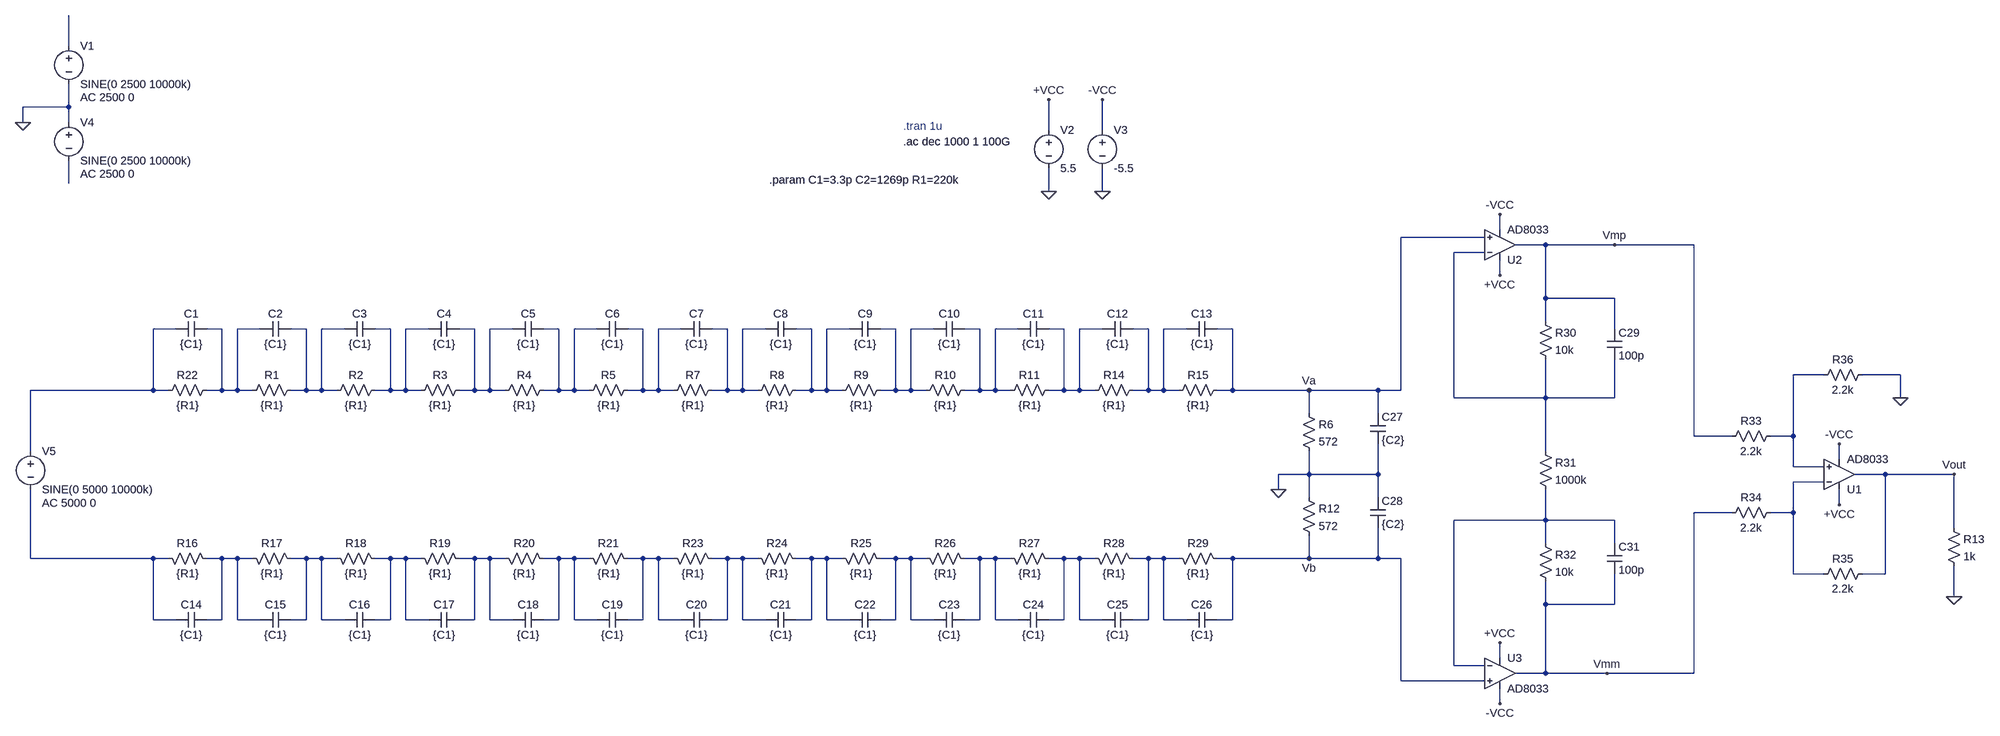
[diagram p0: schematic InputCircuit_Test3.asc]
InputCircuit_Test3.asc, the LTspice schematic file:
Version 4
SHEET 1 2388 756
WIRE -1920 -752 -1920 -816
WIRE -1920 -624 -1920 -672
WIRE -1920 -624 -2016 -624
WIRE -2016 -592 -2016 -624
WIRE -1920 -592 -1920 -624
WIRE 128 -576 128 -640
WIRE 240 -576 240 -640
WIRE -1920 -464 -1920 -512
WIRE 128 -448 128 -496
WIRE 240 -448 240 -496
WIRE 1184 -368 1184 -400
WIRE 1152 -352 864 -352
WIRE 1280 -336 1216 -336
WIRE 1424 -336 1280 -336
WIRE 1776 -336 1424 -336
WIRE 1152 -320 1088 -320
WIRE 1184 -272 1184 -304
WIRE 1280 -224 1280 -336
WIRE 1424 -224 1280 -224
WIRE 1280 -176 1280 -224
WIRE -1696 -160 -1744 -160
WIRE -1600 -160 -1632 -160
WIRE -1520 -160 -1568 -160
WIRE -1424 -160 -1456 -160
WIRE -1344 -160 -1392 -160
WIRE -1248 -160 -1280 -160
WIRE -1168 -160 -1216 -160
WIRE -1072 -160 -1104 -160
WIRE -992 -160 -1040 -160
WIRE -896 -160 -928 -160
WIRE -816 -160 -864 -160
WIRE -720 -160 -752 -160
WIRE -640 -160 -688 -160
WIRE -544 -160 -576 -160
WIRE -464 -160 -512 -160
WIRE -368 -160 -400 -160
WIRE -288 -160 -336 -160
WIRE -192 -160 -224 -160
WIRE -112 -160 -160 -160
WIRE -16 -160 -48 -160
WIRE 64 -160 16 -160
WIRE 160 -160 128 -160
WIRE 240 -160 192 -160
WIRE 336 -160 304 -160
WIRE 416 -160 368 -160
WIRE 512 -160 480 -160
WIRE 1424 -160 1424 -224
WIRE 2048 -64 1984 -64
WIRE 2208 -64 2128 -64
WIRE -1744 -32 -1744 -160
WIRE -1744 -32 -2000 -32
WIRE -1712 -32 -1744 -32
WIRE -1600 -32 -1600 -160
WIRE -1600 -32 -1632 -32
WIRE -1568 -32 -1568 -160
WIRE -1568 -32 -1600 -32
WIRE -1536 -32 -1568 -32
WIRE -1424 -32 -1424 -160
WIRE -1424 -32 -1456 -32
WIRE -1392 -32 -1392 -160
WIRE -1392 -32 -1424 -32
WIRE -1360 -32 -1392 -32
WIRE -1248 -32 -1248 -160
WIRE -1248 -32 -1280 -32
WIRE -1216 -32 -1216 -160
WIRE -1216 -32 -1248 -32
WIRE -1184 -32 -1216 -32
WIRE -1072 -32 -1072 -160
WIRE -1072 -32 -1104 -32
WIRE -1040 -32 -1040 -160
WIRE -1040 -32 -1072 -32
WIRE -1008 -32 -1040 -32
WIRE -896 -32 -896 -160
WIRE -896 -32 -928 -32
WIRE -864 -32 -864 -160
WIRE -864 -32 -896 -32
WIRE -832 -32 -864 -32
WIRE -720 -32 -720 -160
WIRE -720 -32 -752 -32
WIRE -688 -32 -688 -160
WIRE -688 -32 -720 -32
WIRE -656 -32 -688 -32
WIRE -544 -32 -544 -160
WIRE -544 -32 -576 -32
WIRE -512 -32 -512 -160
WIRE -512 -32 -544 -32
WIRE -480 -32 -512 -32
WIRE -368 -32 -368 -160
WIRE -368 -32 -400 -32
WIRE -336 -32 -336 -160
WIRE -336 -32 -368 -32
WIRE -304 -32 -336 -32
WIRE -192 -32 -192 -160
WIRE -192 -32 -224 -32
WIRE -160 -32 -160 -160
WIRE -160 -32 -192 -32
WIRE -128 -32 -160 -32
WIRE -16 -32 -16 -160
WIRE -16 -32 -48 -32
WIRE 16 -32 16 -160
WIRE 16 -32 -16 -32
WIRE 48 -32 16 -32
WIRE 160 -32 160 -160
WIRE 160 -32 128 -32
WIRE 192 -32 192 -160
WIRE 192 -32 160 -32
WIRE 224 -32 192 -32
WIRE 336 -32 336 -160
WIRE 336 -32 304 -32
WIRE 368 -32 368 -160
WIRE 368 -32 336 -32
WIRE 400 -32 368 -32
WIRE 512 -32 512 -160
WIRE 512 -32 480 -32
WIRE 672 -32 512 -32
WIRE 816 -32 672 -32
WIRE 864 -32 864 -352
WIRE 864 -32 816 -32
WIRE 1088 -16 1088 -320
WIRE 1280 -16 1280 -96
WIRE 1280 -16 1088 -16
WIRE 1424 -16 1424 -96
WIRE 1424 -16 1280 -16
WIRE 2208 -16 2208 -64
WIRE 672 16 672 -32
WIRE 816 16 816 -32
WIRE 1776 64 1776 -336
WIRE 1856 64 1776 64
WIRE 1984 64 1984 -64
WIRE 1984 64 1936 64
WIRE -2000 96 -2000 -32
WIRE 1280 96 1280 -16
WIRE 2080 112 2080 80
WIRE 1984 128 1984 64
WIRE 2048 128 1984 128
WIRE 672 144 672 96
WIRE 672 144 608 144
WIRE 816 144 816 80
WIRE 816 144 672 144
WIRE 2176 144 2112 144
WIRE 2320 144 2176 144
WIRE 2048 160 1984 160
WIRE 608 176 608 144
WIRE 672 192 672 144
WIRE 816 192 816 144
WIRE 2080 208 2080 176
WIRE 1856 224 1776 224
WIRE 1984 224 1984 160
WIRE 1984 224 1936 224
WIRE 1280 240 1280 176
WIRE 1280 240 1088 240
WIRE 1424 240 1280 240
WIRE 2320 256 2320 144
WIRE 1280 288 1280 240
WIRE 1424 288 1424 240
WIRE -2000 320 -2000 176
WIRE -1744 320 -2000 320
WIRE -1712 320 -1744 320
WIRE -1600 320 -1632 320
WIRE -1568 320 -1600 320
WIRE -1536 320 -1568 320
WIRE -1424 320 -1456 320
WIRE -1392 320 -1424 320
WIRE -1360 320 -1392 320
WIRE -1248 320 -1280 320
WIRE -1216 320 -1248 320
WIRE -1184 320 -1216 320
WIRE -1072 320 -1104 320
WIRE -1040 320 -1072 320
WIRE -1008 320 -1040 320
WIRE -896 320 -928 320
WIRE -864 320 -896 320
WIRE -832 320 -864 320
WIRE -720 320 -752 320
WIRE -688 320 -720 320
WIRE -656 320 -688 320
WIRE -544 320 -576 320
WIRE -512 320 -544 320
WIRE -480 320 -512 320
WIRE -368 320 -400 320
WIRE -336 320 -368 320
WIRE -304 320 -336 320
WIRE -192 320 -224 320
WIRE -160 320 -192 320
WIRE -128 320 -160 320
WIRE -16 320 -48 320
WIRE 16 320 -16 320
WIRE 48 320 16 320
WIRE 160 320 128 320
WIRE 192 320 160 320
WIRE 224 320 192 320
WIRE 336 320 304 320
WIRE 368 320 336 320
WIRE 400 320 368 320
WIRE 512 320 480 320
WIRE 672 320 672 272
WIRE 672 320 512 320
WIRE 816 320 816 256
WIRE 816 320 672 320
WIRE 864 320 816 320
WIRE 1984 352 1984 224
WIRE 2048 352 1984 352
WIRE 2176 352 2176 144
WIRE 2176 352 2128 352
WIRE 2320 400 2320 336
WIRE 1280 416 1280 368
WIRE 1424 416 1424 352
WIRE 1424 416 1280 416
WIRE -1744 448 -1744 320
WIRE -1696 448 -1744 448
WIRE -1600 448 -1600 320
WIRE -1600 448 -1632 448
WIRE -1568 448 -1568 320
WIRE -1520 448 -1568 448
WIRE -1424 448 -1424 320
WIRE -1424 448 -1456 448
WIRE -1392 448 -1392 320
WIRE -1344 448 -1392 448
WIRE -1248 448 -1248 320
WIRE -1248 448 -1280 448
WIRE -1216 448 -1216 320
WIRE -1168 448 -1216 448
WIRE -1072 448 -1072 320
WIRE -1072 448 -1104 448
WIRE -1040 448 -1040 320
WIRE -992 448 -1040 448
WIRE -896 448 -896 320
WIRE -896 448 -928 448
WIRE -864 448 -864 320
WIRE -816 448 -864 448
WIRE -720 448 -720 320
WIRE -720 448 -752 448
WIRE -688 448 -688 320
WIRE -640 448 -688 448
WIRE -544 448 -544 320
WIRE -544 448 -576 448
WIRE -512 448 -512 320
WIRE -464 448 -512 448
WIRE -368 448 -368 320
WIRE -368 448 -400 448
WIRE -336 448 -336 320
WIRE -288 448 -336 448
WIRE -192 448 -192 320
WIRE -192 448 -224 448
WIRE -160 448 -160 320
WIRE -112 448 -160 448
WIRE -16 448 -16 320
WIRE -16 448 -48 448
WIRE 16 448 16 320
WIRE 64 448 16 448
WIRE 160 448 160 320
WIRE 160 448 128 448
WIRE 192 448 192 320
WIRE 240 448 192 448
WIRE 336 448 336 320
WIRE 336 448 304 448
WIRE 368 448 368 320
WIRE 416 448 368 448
WIRE 512 448 512 320
WIRE 512 448 480 448
WIRE 1184 528 1184 496
WIRE 1088 544 1088 240
WIRE 1152 544 1088 544
WIRE 1280 560 1280 416
WIRE 1280 560 1216 560
WIRE 1408 560 1280 560
WIRE 1776 560 1776 224
WIRE 1776 560 1408 560
WIRE 864 576 864 320
WIRE 1152 576 864 576
WIRE 1184 624 1184 592
FLAG 672 -32 Va
FLAG 672 320 Vb
FLAG 608 176 0
FLAG 128 -448 0
FLAG 240 -448 0
FLAG 128 -640 +VCC
FLAG 240 -640 -VCC
FLAG 2320 400 0
FLAG -2016 -592 0
FLAG 2320 144 Vout
FLAG 1424 -336 Vmp
FLAG 1184 -272 +VCC
FLAG 1184 -400 -VCC
FLAG 1184 496 +VCC
FLAG 1184 624 -VCC
FLAG 1408 560 Vmm
FLAG 2080 208 +VCC
FLAG 2080 80 -VCC
FLAG 2208 -16 0
SYMBOL voltage -1920 -768 R0
WINDOW 123 24 124 Left 2
WINDOW 39 0 0 Left 0
SYMATTR Value2 AC 2500 0
SYMATTR InstName V1
SYMATTR Value SINE(0 2500 10000k)
SYMBOL res 656 0 R0
SYMATTR InstName R6
SYMATTR Value 572
SYMATTR SpiceLine tol=1 pwr=0.1
SYMBOL res 656 176 R0
SYMATTR InstName R12
SYMATTR Value 572
SYMATTR SpiceLine tol=1 pwr=0.1
SYMBOL voltage 128 -592 R0
WINDOW 123 0 0 Left 0
WINDOW 39 0 0 Left 0
SYMATTR InstName V2
SYMATTR Value 5.5
SYMBOL voltage 240 -592 R0
WINDOW 123 0 0 Left 0
WINDOW 39 0 0 Left 0
SYMATTR InstName V3
SYMATTR Value -5.5
SYMBOL res -1616 -48 R90
WINDOW 0 0 56 VBottom 2
WINDOW 3 32 56 VTop 2
SYMATTR InstName R22
SYMATTR Value {R1}
SYMATTR SpiceLine tol=0 pwr=1
SYMBOL res 2304 240 R0
SYMATTR InstName R13
SYMATTR Value 1k
SYMBOL voltage -1920 -608 R0
WINDOW 123 24 124 Left 2
WINDOW 39 0 0 Left 0
SYMATTR Value2 AC 2500 0
SYMATTR InstName V4
SYMATTR Value SINE(0 2500 10000k)
SYMBOL voltage -2000 80 R0
WINDOW 123 24 124 Left 2
WINDOW 39 0 0 Left 0
SYMATTR Value2 AC 5000 0
SYMATTR InstName V5
SYMATTR Value SINE(0 5000 10000k)
SYMBOL cap -1632 -176 R90
WINDOW 0 0 32 VBottom 2
WINDOW 3 32 32 VTop 2
SYMATTR InstName C1
SYMATTR Value {C1}
SYMBOL res -1440 -48 R90
WINDOW 0 0 56 VBottom 2
WINDOW 3 32 56 VTop 2
SYMATTR InstName R1
SYMATTR Value {R1}
SYMATTR SpiceLine tol=0 pwr=1
SYMBOL cap -1456 -176 R90
WINDOW 0 0 32 VBottom 2
WINDOW 3 32 32 VTop 2
SYMATTR InstName C2
SYMATTR Value {C1}
SYMBOL res -1264 -48 R90
WINDOW 0 0 56 VBottom 2
WINDOW 3 32 56 VTop 2
SYMATTR InstName R2
SYMATTR Value {R1}
SYMATTR SpiceLine tol=0 pwr=1
SYMBOL cap -1280 -176 R90
WINDOW 0 0 32 VBottom 2
WINDOW 3 32 32 VTop 2
SYMATTR InstName C3
SYMATTR Value {C1}
SYMBOL res -1088 -48 R90
WINDOW 0 0 56 VBottom 2
WINDOW 3 32 56 VTop 2
SYMATTR InstName R3
SYMATTR Value {R1}
SYMATTR SpiceLine tol=0 pwr=1
SYMBOL cap -1104 -176 R90
WINDOW 0 0 32 VBottom 2
WINDOW 3 32 32 VTop 2
SYMATTR InstName C4
SYMATTR Value {C1}
SYMBOL res -912 -48 R90
WINDOW 0 0 56 VBottom 2
WINDOW 3 32 56 VTop 2
SYMATTR InstName R4
SYMATTR Value {R1}
SYMATTR SpiceLine tol=0 pwr=1
SYMBOL cap -928 -176 R90
WINDOW 0 0 32 VBottom 2
WINDOW 3 32 32 VTop 2
SYMATTR InstName C5
SYMATTR Value {C1}
SYMBOL res -736 -48 R90
WINDOW 0 0 56 VBottom 2
WINDOW 3 32 56 VTop 2
SYMATTR InstName R5
SYMATTR Value {R1}
SYMATTR SpiceLine tol=0 pwr=1
SYMBOL cap -752 -176 R90
WINDOW 0 0 32 VBottom 2
WINDOW 3 32 32 VTop 2
SYMATTR InstName C6
SYMATTR Value {C1}
SYMBOL res -560 -48 R90
WINDOW 0 0 56 VBottom 2
WINDOW 3 32 56 VTop 2
SYMATTR InstName R7
SYMATTR Value {R1}
SYMATTR SpiceLine tol=0 pwr=1
SYMBOL cap -576 -176 R90
WINDOW 0 0 32 VBottom 2
WINDOW 3 32 32 VTop 2
SYMATTR InstName C7
SYMATTR Value {C1}
SYMBOL res -384 -48 R90
WINDOW 0 0 56 VBottom 2
WINDOW 3 32 56 VTop 2
SYMATTR InstName R8
SYMATTR Value {R1}
SYMATTR SpiceLine tol=0 pwr=1
SYMBOL cap -400 -176 R90
WINDOW 0 0 32 VBottom 2
WINDOW 3 32 32 VTop 2
SYMATTR InstName C8
SYMATTR Value {C1}
SYMBOL res -208 -48 R90
WINDOW 0 0 56 VBottom 2
WINDOW 3 32 56 VTop 2
SYMATTR InstName R9
SYMATTR Value {R1}
SYMATTR SpiceLine tol=0 pwr=1
SYMBOL cap -224 -176 R90
WINDOW 0 0 32 VBottom 2
WINDOW 3 32 32 VTop 2
SYMATTR InstName C9
SYMATTR Value {C1}
SYMBOL res -32 -48 R90
WINDOW 0 0 56 VBottom 2
WINDOW 3 32 56 VTop 2
SYMATTR InstName R10
SYMATTR Value {R1}
SYMATTR SpiceLine tol=0 pwr=1
SYMBOL cap -48 -176 R90
WINDOW 0 0 32 VBottom 2
WINDOW 3 32 32 VTop 2
SYMATTR InstName C10
SYMATTR Value {C1}
SYMBOL res 144 -48 R90
WINDOW 0 0 56 VBottom 2
WINDOW 3 32 56 VTop 2
SYMATTR InstName R11
SYMATTR Value {R1}
SYMATTR SpiceLine tol=0 pwr=1
SYMBOL cap 128 -176 R90
WINDOW 0 0 32 VBottom 2
WINDOW 3 32 32 VTop 2
SYMATTR InstName C11
SYMATTR Value {C1}
SYMBOL res 320 -48 R90
WINDOW 0 0 56 VBottom 2
WINDOW 3 32 56 VTop 2
SYMATTR InstName R14
SYMATTR Value {R1}
SYMATTR SpiceLine tol=0 pwr=1
SYMBOL cap 304 -176 R90
WINDOW 0 0 32 VBottom 2
WINDOW 3 32 32 VTop 2
SYMATTR InstName C12
SYMATTR Value {C1}
SYMBOL res 496 -48 R90
WINDOW 0 0 56 VBottom 2
WINDOW 3 32 56 VTop 2
SYMATTR InstName R15
SYMATTR Value {R1}
SYMATTR SpiceLine tol=0 pwr=1
SYMBOL cap 480 -176 R90
WINDOW 0 0 32 VBottom 2
WINDOW 3 32 32 VTop 2
SYMATTR InstName C13
SYMATTR Value {C1}
SYMBOL res -1616 336 M270
WINDOW 0 32 56 VTop 2
WINDOW 3 0 56 VBottom 2
SYMATTR InstName R16
SYMATTR Value {R1}
SYMATTR SpiceLine tol=0 pwr=1
SYMBOL cap -1632 464 M270
WINDOW 0 32 32 VTop 2
WINDOW 3 0 32 VBottom 2
SYMATTR InstName C14
SYMATTR Value {C1}
SYMBOL res -1440 336 M270
WINDOW 0 32 56 VTop 2
WINDOW 3 0 56 VBottom 2
SYMATTR InstName R17
SYMATTR Value {R1}
SYMATTR SpiceLine tol=0 pwr=1
SYMBOL cap -1456 464 M270
WINDOW 0 32 32 VTop 2
WINDOW 3 0 32 VBottom 2
SYMATTR InstName C15
SYMATTR Value {C1}
SYMBOL res -1264 336 M270
WINDOW 0 32 56 VTop 2
WINDOW 3 0 56 VBottom 2
SYMATTR InstName R18
SYMATTR Value {R1}
SYMATTR SpiceLine tol=0 pwr=1
SYMBOL cap -1280 464 M270
WINDOW 0 32 32 VTop 2
WINDOW 3 0 32 VBottom 2
SYMATTR InstName C16
SYMATTR Value {C1}
SYMBOL res -1088 336 M270
WINDOW 0 32 56 VTop 2
WINDOW 3 0 56 VBottom 2
SYMATTR InstName R19
SYMATTR Value {R1}
SYMATTR SpiceLine tol=0 pwr=1
SYMBOL cap -1104 464 M270
WINDOW 0 32 32 VTop 2
WINDOW 3 0 32 VBottom 2
SYMATTR InstName C17
SYMATTR Value {C1}
SYMBOL res -912 336 M270
WINDOW 0 32 56 VTop 2
WINDOW 3 0 56 VBottom 2
SYMATTR InstName R20
SYMATTR Value {R1}
SYMATTR SpiceLine tol=0 pwr=1
SYMBOL cap -928 464 M270
WINDOW 0 32 32 VTop 2
WINDOW 3 0 32 VBottom 2
SYMATTR InstName C18
SYMATTR Value {C1}
SYMBOL res -736 336 M270
WINDOW 0 32 56 VTop 2
WINDOW 3 0 56 VBottom 2
SYMATTR InstName R21
SYMATTR Value {R1}
SYMATTR SpiceLine tol=0 pwr=1
SYMBOL cap -752 464 M270
WINDOW 0 32 32 VTop 2
WINDOW 3 0 32 VBottom 2
SYMATTR InstName C19
SYMATTR Value {C1}
SYMBOL res -560 336 M270
WINDOW 0 32 56 VTop 2
WINDOW 3 0 56 VBottom 2
SYMATTR InstName R23
SYMATTR Value {R1}
SYMATTR SpiceLine tol=0 pwr=1
SYMBOL cap -576 464 M270
WINDOW 0 32 32 VTop 2
WINDOW 3 0 32 VBottom 2
SYMATTR InstName C20
SYMATTR Value {C1}
SYMBOL res -384 336 M270
WINDOW 0 32 56 VTop 2
WINDOW 3 0 56 VBottom 2
SYMATTR InstName R24
SYMATTR Value {R1}
SYMATTR SpiceLine tol=0 pwr=1
SYMBOL cap -400 464 M270
WINDOW 0 32 32 VTop 2
WINDOW 3 0 32 VBottom 2
SYMATTR InstName C21
SYMATTR Value {C1}
SYMBOL res -208 336 M270
WINDOW 0 32 56 VTop 2
WINDOW 3 0 56 VBottom 2
SYMATTR InstName R25
SYMATTR Value {R1}
SYMATTR SpiceLine tol=0 pwr=1
SYMBOL cap -224 464 M270
WINDOW 0 32 32 VTop 2
WINDOW 3 0 32 VBottom 2
SYMATTR InstName C22
SYMATTR Value {C1}
SYMBOL res -32 336 M270
WINDOW 0 32 56 VTop 2
WINDOW 3 0 56 VBottom 2
SYMATTR InstName R26
SYMATTR Value {R1}
SYMATTR SpiceLine tol=0 pwr=1
SYMBOL cap -48 464 M270
WINDOW 0 32 32 VTop 2
WINDOW 3 0 32 VBottom 2
SYMATTR InstName C23
SYMATTR Value {C1}
SYMBOL res 144 336 M270
WINDOW 0 32 56 VTop 2
WINDOW 3 0 56 VBottom 2
SYMATTR InstName R27
SYMATTR Value {R1}
SYMATTR SpiceLine tol=0 pwr=1
SYMBOL cap 128 464 M270
WINDOW 0 32 32 VTop 2
WINDOW 3 0 32 VBottom 2
SYMATTR InstName C24
SYMATTR Value {C1}
SYMBOL res 320 336 M270
WINDOW 0 32 56 VTop 2
WINDOW 3 0 56 VBottom 2
SYMATTR InstName R28
SYMATTR Value {R1}
SYMATTR SpiceLine tol=0 pwr=1
SYMBOL cap 304 464 M270
WINDOW 0 32 32 VTop 2
WINDOW 3 0 32 VBottom 2
SYMATTR InstName C25
SYMATTR Value {C1}
SYMBOL res 496 336 M270
WINDOW 0 32 56 VTop 2
WINDOW 3 0 56 VBottom 2
SYMATTR InstName R29
SYMATTR Value {R1}
SYMATTR SpiceLine tol=0 pwr=1
SYMBOL cap 480 464 M270
WINDOW 0 32 32 VTop 2
WINDOW 3 0 32 VBottom 2
SYMATTR InstName C26
SYMATTR Value {C1}
SYMBOL cap 800 16 R0
SYMATTR InstName C27
SYMATTR Value {C2}
SYMBOL cap 800 192 R0
SYMATTR InstName C28
SYMATTR Value {C2}
SYMBOL OpAmps\\AD8033 1184 -272 M180
SYMATTR InstName U2
SYMBOL OpAmps\\AD8033 1184 496 R0
SYMATTR InstName U3
SYMBOL res 1264 -192 R0
SYMATTR InstName R30
SYMATTR Value 10k
SYMBOL res 1264 80 R0
SYMATTR InstName R31
SYMATTR Value 1000k
SYMBOL res 1264 272 R0
SYMATTR InstName R32
SYMATTR Value 10k
SYMBOL cap 1408 -160 R0
SYMATTR InstName C29
SYMATTR Value 100p
SYMBOL cap 1408 288 R0
SYMATTR InstName C31
SYMATTR Value 100p
SYMBOL OpAmps\\AD8033 2080 208 M180
SYMATTR InstName U1
SYMBOL res 1952 48 R90
WINDOW 0 0 56 VBottom 2
WINDOW 3 32 56 VTop 2
SYMATTR InstName R33
SYMATTR Value 2.2k
SYMBOL res 1952 208 R90
WINDOW 0 0 56 VBottom 2
WINDOW 3 32 56 VTop 2
SYMATTR InstName R34
SYMATTR Value 2.2k
SYMBOL res 2144 336 R90
WINDOW 0 0 56 VBottom 2
WINDOW 3 32 56 VTop 2
SYMATTR InstName R35
SYMATTR Value 2.2k
SYMBOL res 2144 -80 R90
WINDOW 0 0 56 VBottom 2
WINDOW 3 32 56 VTop 2
SYMATTR InstName R36
SYMATTR Value 2.2k
TEXT -176 -584 Left 2 ;.tran 1u
TEXT -176 -552 Left 2 !.ac dec 1000 1 100G
TEXT -456 -472 Left 2 !.param C1=3.3p C2=1269p R1=220k

The netlist it stands for:
* InputCircuit_Test3.asc
V1 N001 0 SINE(0 2500 10000k) AC 2500 0
R6 Va 0 572 tol=1 pwr=0.1
R12 0 Vb 572 tol=1 pwr=0.1
V2 +VCC 0 5.5
V3 -VCC 0 -5.5
R22 N005 N004 {R1} tol=0 pwr=1
R13 Vout 0 1k
V4 0 N002 SINE(0 2500 10000k) AC 2500 0
V5 N004 N020 SINE(0 5000 10000k) AC 5000 0
C1 N005 N004 {C1}
R1 N006 N005 {R1} tol=0 pwr=1
C2 N006 N005 {C1}
R2 N007 N006 {R1} tol=0 pwr=1
C3 N007 N006 {C1}
R3 N008 N007 {R1} tol=0 pwr=1
C4 N008 N007 {C1}
R4 N009 N008 {R1} tol=0 pwr=1
C5 N009 N008 {C1}
R5 N010 N009 {R1} tol=0 pwr=1
C6 N010 N009 {C1}
R7 N011 N010 {R1} tol=0 pwr=1
C7 N011 N010 {C1}
R8 N012 N011 {R1} tol=0 pwr=1
C8 N012 N011 {C1}
R9 N013 N012 {R1} tol=0 pwr=1
C9 N013 N012 {C1}
R10 N014 N013 {R1} tol=0 pwr=1
C10 N014 N013 {C1}
R11 N015 N014 {R1} tol=0 pwr=1
C11 N015 N014 {C1}
R14 N016 N015 {R1} tol=0 pwr=1
C12 N016 N015 {C1}
R15 Va N016 {R1} tol=0 pwr=1
C13 Va N016 {C1}
R16 N021 N020 {R1} tol=0 pwr=1
C14 N021 N020 {C1}
R17 N022 N021 {R1} tol=0 pwr=1
C15 N022 N021 {C1}
R18 N023 N022 {R1} tol=0 pwr=1
C16 N023 N022 {C1}
R19 N024 N023 {R1} tol=0 pwr=1
C17 N024 N023 {C1}
R20 N025 N024 {R1} tol=0 pwr=1
C18 N025 N024 {C1}
R21 N026 N025 {R1} tol=0 pwr=1
C19 N026 N025 {C1}
R23 N027 N026 {R1} tol=0 pwr=1
C20 N027 N026 {C1}
R24 N028 N027 {R1} tol=0 pwr=1
C21 N028 N027 {C1}
R25 N029 N028 {R1} tol=0 pwr=1
C22 N029 N028 {C1}
R26 N030 N029 {R1} tol=0 pwr=1
C23 N030 N029 {C1}
R27 N031 N030 {R1} tol=0 pwr=1
C24 N031 N030 {C1}
R28 N032 N031 {R1} tol=0 pwr=1
C25 N032 N031 {C1}
R29 Vb N032 {R1} tol=0 pwr=1
C26 Vb N032 {C1}
C27 Va 0 {C2}
C28 0 Vb {C2}
XU2 Va N003 +VCC -VCC Vmp AD8033  ; pins In+ In- V+ V- OUT
XU3 Vb N019 +VCC -VCC Vmm AD8033  ; pins In+ In- V+ V- OUT
R30 Vmp N003 10k
R31 N003 N019 1000k
R32 N019 Vmm 10k
C29 Vmp N003 100p
C31 N019 Vmm 100p
XU1 N017 N018 +VCC -VCC Vout AD8033  ; pins In+ In- V+ V- OUT
R33 N017 Vmp 2.2k
R34 N018 Vmm 2.2k
R35 Vout N018 2.2k
R36 0 N017 2.2k
* .tran 1u
.ac dec 1000 1 100G
.param C1=3.3p C2=1269p R1=220k
.backanno
.end